# Altium schematic sheet Sheet1.SchDoc
size A4
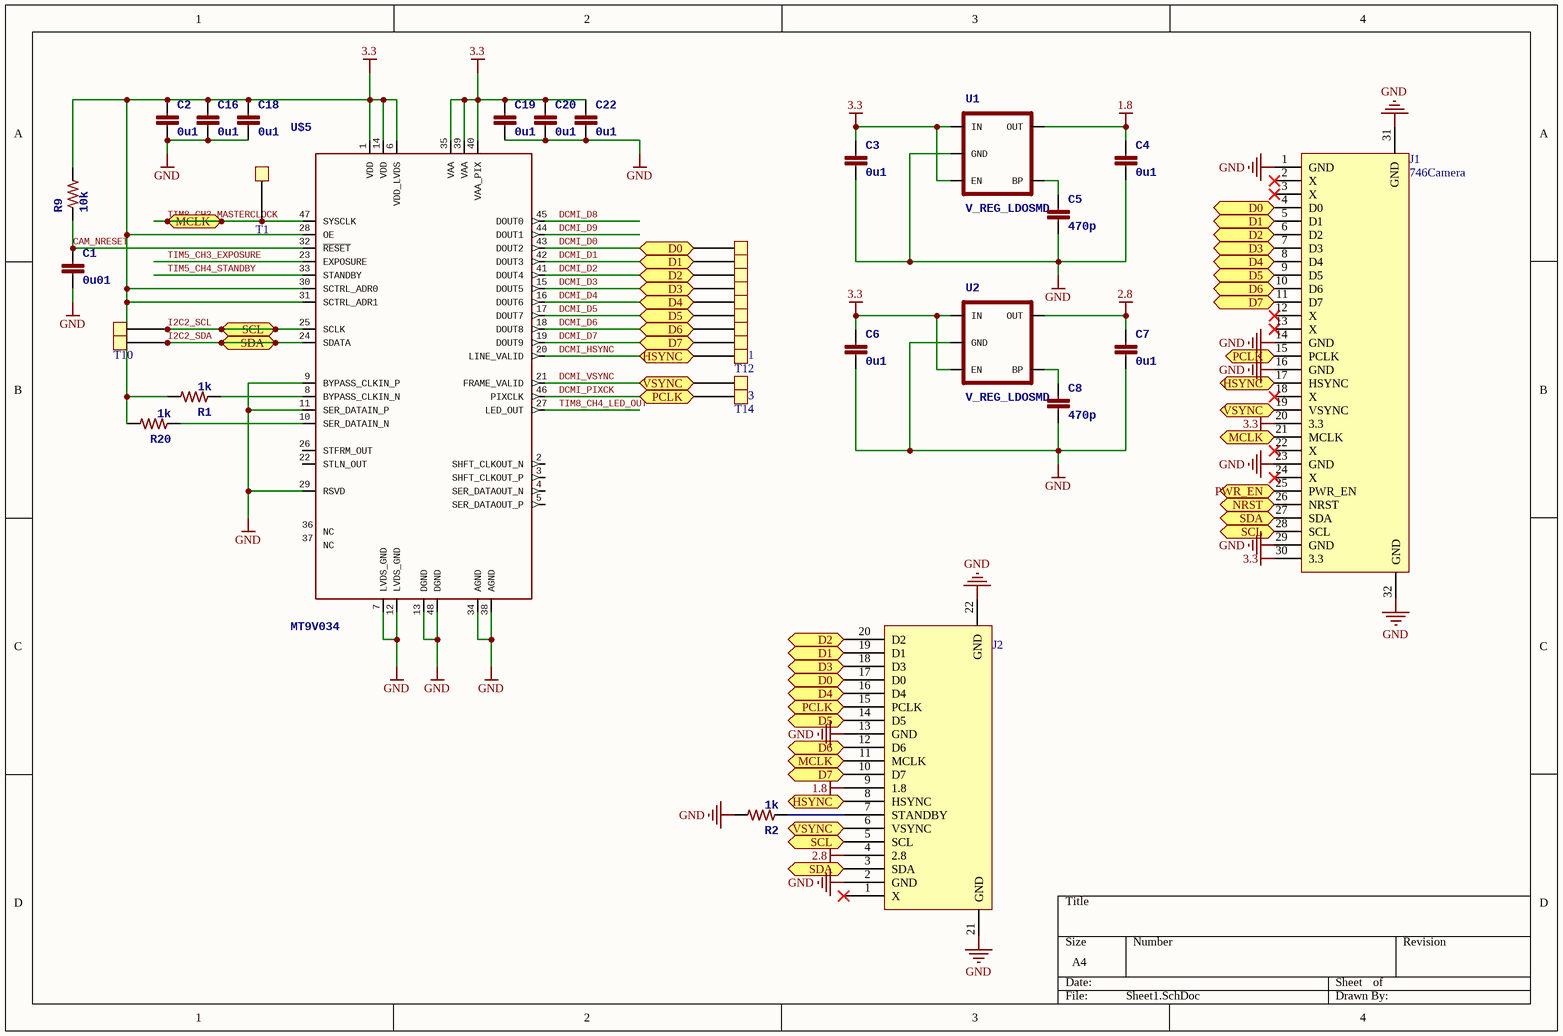
[diagram p0: Sheet1.SchDoc]

## Parts
C1  0u01  [0603-CAP]
C2  0u1  [0603-CAP]
C3  0u1  [0603-CAP]
C4  0u1  [0603-CAP]
C5  470p  [0603-CAP]
C6  0u1  [0603-CAP]
C7  0u1  [0603-CAP]
C8  470p  [0603-CAP]
C16  0u1  [0603-CAP]
C18  0u1  [0603-CAP]
C19  0u1  [0603-CAP]
C20  0u1  [0603-CAP]
C22  0u1  [0603-CAP]
J1  746Camera  [FFC/SM0.5-2H30]
J2  OV7675Socket  [FFC/SM0.5-2H20]  (value not drawn)
R1  1k  [0603-RES]
R2  1k  [0603-RES]
R9  10k  [0603-RES]
R20  1k  [0603-RES]
T1  TestPad  [PAD.05X.05]  (value not drawn)
T2  TestPad  [PAD.05X.05]  (value not drawn)
T3  TestPad  [PAD.05X.05]  (value not drawn)
T4  TestPad  [PAD.05X.05]  (value not drawn)
T5  TestPad  [PAD.05X.05]  (value not drawn)
T6  TestPad  [PAD.05X.05]  (value not drawn)
T7  TestPad  [PAD.05X.05]  (value not drawn)
T8  TestPad  [PAD.05X.05]  (value not drawn)
T9  TestPad  [PAD.05X.05]  (value not drawn)
T10  TestPad  [PAD.05X.05]  (value not drawn)
T11  TestPad  [PAD.05X.05]  (value not drawn)
T12  TestPad  [PAD.05X.05]  (value not drawn)
T13  TestPad  [PAD.05X.05]  (value not drawn)
T14  TestPad  [PAD.05X.05]  (value not drawn)
U1  V_REG_LDOSMD  [SOT23-5]
U2  V_REG_LDOSMD  [SOT23-5]
U$5  MT9V034  [CLCC-48]

## Ports
D0, D1, D2, D3, D4, D5, D6, D7, HSYNC, MCLK, NRST, PCLK, PWR_EN, SCL, SDA, VSYNC

## Nets
1.8: C4.1 J2.9(1.8) U1.5(OUT)
2.8: C7.1 J2.4(2.8) U2.5(OUT)
3.3: C2.1 C3.1 C6.1 C16.1 C18.1 C19.1 C20.1 C22.1 J1.20(3.3) J1.30(3.3) R1.2 R9.2 R20.2 U1.1(IN) U1.3(EN) U2.1(IN) U2.3(EN) U$5.1(VDD) U$5.6(VDD_LVDS) U$5.14(VDD) U$5.28(OE) U$5.30(SCTRL_ADR0) U$5.31(SCTRL_ADR1) U$5.35(VAA) U$5.39(VAA) U$5.40(VAA_PIX)
GND: C1.2 C2.2 C3.2 C4.2 C5.2 C6.2 C7.2 C8.2 C16.2 C18.2 C19.2 C20.2 C22.2 J1.1(GND) J1.14(GND) J1.16(GND) J1.23(GND) J1.29(GND) J1.31(GND) J1.32(GND) J2.2(GND) J2.13(GND) J2.21(GND) J2.22(GND) R2.2 U1.2(GND) U2.2(GND) U$5.7(LVDS_GND) U$5.9(BYPASS_CLKIN_P) U$5.11(SER_DATAIN_P) U$5.12(LVDS_GND) U$5.13(DGND) U$5.29(RSVD) U$5.34(AGND) U$5.38(AGND) U$5.48(DGND)
CAM_NRESET: C1.1 R9.1 U$5.32(~{RESET})
DCMI_D0: J1.4(D0) J2.17(D0) T2.1 U$5.43(DOUT2) ; port D0
DCMI_D1: J1.5(D1) J2.19(D1) T3.1 U$5.42(DOUT3) ; port D1
DCMI_D2: J1.6(D2) J2.20(D2) T4.1 U$5.41(DOUT4) ; port D2
DCMI_D3: J1.7(D3) J2.18(D3) T5.1 U$5.15(DOUT5) ; port D3
DCMI_D4: J1.8(D4) J2.16(D4) T6.1 U$5.16(DOUT6) ; port D4
DCMI_D5: J1.9(D5) J2.14(D5) T7.1 U$5.17(DOUT7) ; port D5
DCMI_D6: J1.10(D6) J2.12(D6) T9.1 U$5.18(DOUT8) ; port D6
DCMI_D7: J1.11(D7) J2.10(D7) T11.1 U$5.19(DOUT9) ; port D7
DCMI_D8: U$5.45(DOUT0)
DCMI_D9: U$5.44(DOUT1)
DCMI_HSYNC: J1.17(HSYNC) J2.8(HSYNC) T12.1 U$5.20(LINE_VALID) ; port HSYNC
DCMI_PIXCK: J1.15(PCLK) J2.15(PCLK) T14.1 U$5.46(PIXCLK) ; port PCLK
DCMI_VSYNC: J1.19(VSYNC) J2.6(VSYNC) T13.1 U$5.21(FRAME_VALID) ; port VSYNC
I2C2_SCL: J1.28(SCL) J2.5(SCL) T8.1 U$5.25(SCLK) ; port SCL
I2C2_SDA: J1.27(SDA) J2.3(SDA) T10.1 U$5.24(SDATA) ; port SDA
NRST: J1.26(NRST) ; port NRST
PWR_EN: J1.25(PWR_EN) ; port PWR_EN
TIM5_CH3_EXPOSURE: U$5.23(EXPOSURE)
TIM5_CH4_STANDBY: U$5.33(STANDBY)
TIM8_CH3_MASTERCLOCK: J1.21(MCLK) J2.11(MCLK) T1.1 U$5.47(SYSCLK) ; port MCLK
TIM8_CH4_LED_OUT: U$5.27(LED_OUT)
NetC5_1: C5.1 U1.4(BP)
NetC8_1: C8.1 U2.4(BP)
NetJ2_7: J2.7(STANDBY) R2.1
NetR1_1: R1.1 U$5.8(BYPASS_CLKIN_N)
NetR20_1: R20.1 U$5.10(SER_DATAIN_N)

Not connected (* = marked no-connect by the designer): J1 2(X)* 3(X)* 12(X)* 13(X)* 18(X)* 22(X)* 24(X)*; J2 1(X)*; U$5 2(SHFT_CLKOUT_N) 3(SHFT_CLKOUT_P) 4(SER_DATAOUT_N) 5(SER_DATAOUT_P) 22(STLN_OUT) 26(STFRM_OUT) 36(NC) 37(NC)

## Library data of the parts
C1 = CAP0402-CAP: <b>Capacitor</b> / Standard 0603 ceramic capacitor, and 0.1" leaded capacitor.; PARTNO: CC0402KRX7R7BB103
C2-C4 C6 C7 C16 C18-C20 C22 = CAP0402-CAP: <b>Capacitor</b> / Standard 0603 ceramic capacitor, and 0.1" leaded capacitor.; PARTNO: CC0402ZRY5V7BB104
C5 C8 = CAP0402-CAP: <b>Capacitor</b> / Standard 0603 ceramic capacitor, and 0.1" leaded capacitor.; PARTNO: CC0402KRX7R9BB471
R1 R2 R20 = RESISTOR0402-RES: <b>Resistor</b> / Basic schematic elements and footprints for 0603, 1206, and PTH 1/10th watt (small) resistors.; PARTNO: RMCF0402JT1K00
R9 = RESISTOR0402-RES: <b>Resistor</b> / Basic schematic elements and footprints for 0603, 1206, and PTH 1/10th watt (small) resistors.; PARTNO: MCR01MZPJ271
U1 U2 = V_REG_LDOSMD: <b>Voltage Regulator LDO</b> / Standard 150mA LDO voltage regulator in SOT-23 layout. Micrel part MIC5205. BP (by-pass) pin is used to lower output noise with 470pF cap.; PARTNO: MIC5207-3.3YM5
U$5 = MT9V034: PARTNO: MT9V034C12STM